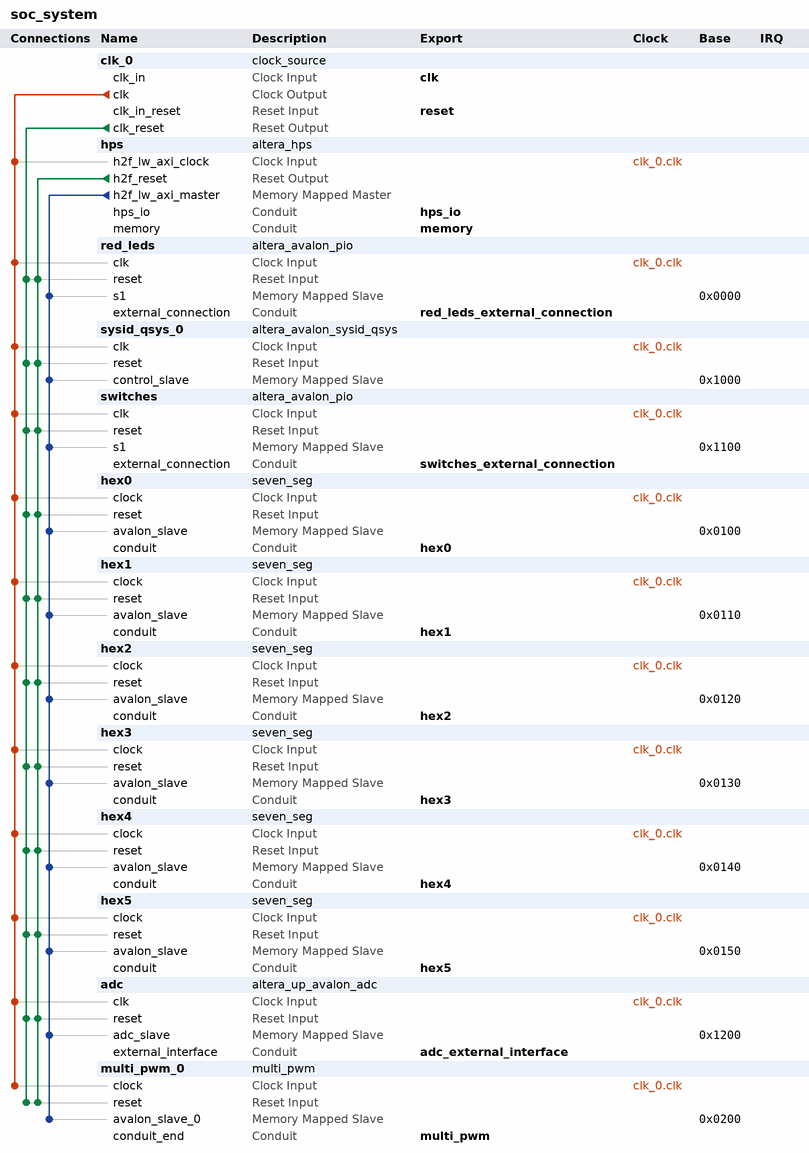
[diagram p0: system contents]
# Platform Designer (Qsys) system soc_system, Cyclone V 5CSEMA5F31C6
# Parameters at their usual value, and those the tool derives, are not listed.
package require -exact qsys 17.0
create_system soc_system
set_project_property DEVICE_FAMILY {Cyclone V}
set_project_property DEVICE 5CSEMA5F31C6

add_instance clk_0 clock_source 17.0
set_instance_parameter_value clk_0 clockFrequency 50000000

add_instance hps altera_hps 17.0
set_instance_parameter_value hps EMAC1_Mode RGMII
set_instance_parameter_value hps EMAC1_PinMuxing {HPS I/O Set 0}
set_instance_parameter_value hps F2SCLK_COLDRST_Enable false
set_instance_parameter_value hps F2SCLK_DBGRST_Enable false
set_instance_parameter_value hps F2SCLK_WARMRST_Enable false
set_instance_parameter_value hps F2SINTERRUPT_Enable false
set_instance_parameter_value hps F2S_Width 0
set_instance_parameter_value hps FPGA_PERIPHERAL_OUTPUT_CLOCK_FREQ_EMAC0_GTX_CLK 125
set_instance_parameter_value hps FPGA_PERIPHERAL_OUTPUT_CLOCK_FREQ_EMAC0_MD_CLK 2.5
set_instance_parameter_value hps FPGA_PERIPHERAL_OUTPUT_CLOCK_FREQ_EMAC1_GTX_CLK 125
set_instance_parameter_value hps FPGA_PERIPHERAL_OUTPUT_CLOCK_FREQ_EMAC1_MD_CLK 2.5
set_instance_parameter_value hps HPS_PROTOCOL DDR3
set_instance_parameter_value hps I2C0_Mode I2C
set_instance_parameter_value hps I2C0_PinMuxing {HPS I/O Set 0}
set_instance_parameter_value hps I2C1_Mode I2C
set_instance_parameter_value hps I2C1_PinMuxing {HPS I/O Set 0}
set_instance_parameter_value hps LWH2F_Enable true
set_instance_parameter_value hps MEM_BANKADDR_WIDTH 3
set_instance_parameter_value hps MEM_CLK_FREQ 400.0
set_instance_parameter_value hps MEM_COL_ADDR_WIDTH 10
set_instance_parameter_value hps MEM_DQ_WIDTH 32
set_instance_parameter_value hps MEM_DRV_STR RZQ/7
set_instance_parameter_value hps MEM_ROW_ADDR_WIDTH 15
set_instance_parameter_value hps MEM_RTT_NOM RZQ/4
set_instance_parameter_value hps MEM_RTT_WR RZQ/4
set_instance_parameter_value hps MEM_TCL 11
set_instance_parameter_value hps MEM_TFAW_NS 30.0
set_instance_parameter_value hps MEM_TRAS_NS 35.0
set_instance_parameter_value hps MEM_TRCD_NS 13.75
set_instance_parameter_value hps MEM_TRFC_NS 260.0
set_instance_parameter_value hps MEM_TRP_NS 13.75
set_instance_parameter_value hps MEM_VENDOR Other
set_instance_parameter_value hps MEM_WTCL 8
set_instance_parameter_value hps QSPI_Mode N/A
set_instance_parameter_value hps QSPI_PinMuxing Unused
set_instance_parameter_value hps REF_CLK_FREQ 25.0
set_instance_parameter_value hps S2FCLK_USER2CLK 5
set_instance_parameter_value hps S2F_Width 0
set_instance_parameter_value hps SDIO_Mode {4-bit Data}
set_instance_parameter_value hps SDIO_PinMuxing {HPS I/O Set 0}
set_instance_parameter_value hps SPIM1_Mode {Single Slave Select}
set_instance_parameter_value hps SPIM1_PinMuxing {HPS I/O Set 0}
set_instance_parameter_value hps STM_Enable false
set_instance_parameter_value hps TIMING_BOARD_AC_SKEW 0.02
set_instance_parameter_value hps TIMING_BOARD_AC_TO_CK_SKEW 0.01
set_instance_parameter_value hps TIMING_BOARD_DQ_TO_DQS_SKEW 0.05
set_instance_parameter_value hps TIMING_BOARD_MAX_CK_DELAY 0.03
set_instance_parameter_value hps TIMING_BOARD_MAX_DQS_DELAY 0.02
set_instance_parameter_value hps TIMING_BOARD_SKEW_BETWEEN_DQS 0.06
set_instance_parameter_value hps TIMING_BOARD_SKEW_CKDQS_DIMM_MAX 0.12
set_instance_parameter_value hps TIMING_BOARD_SKEW_CKDQS_DIMM_MIN 0.06
set_instance_parameter_value hps TIMING_BOARD_SKEW_WITHIN_DQS 0.01
set_instance_parameter_value hps TIMING_TDH 65
set_instance_parameter_value hps TIMING_TDQSCK 255
set_instance_parameter_value hps TIMING_TDQSQ 125
set_instance_parameter_value hps TIMING_TDS 30
set_instance_parameter_value hps TIMING_TIH 140
set_instance_parameter_value hps TIMING_TIS 180
set_instance_parameter_value hps TIMING_TQSH 0.4
set_instance_parameter_value hps UART0_Mode {No Flow Control}
set_instance_parameter_value hps UART0_PinMuxing {HPS I/O Set 0}
set_instance_parameter_value hps USB1_Mode SDR
set_instance_parameter_value hps USB1_PinMuxing {HPS I/O Set 0}
set_instance_parameter_value hps desired_cfg_clk_mhz 100.0
set_instance_parameter_value hps desired_qspi_clk_mhz 400.0
set_instance_parameter_value hps use_default_mpu_clk false

add_instance red_leds altera_avalon_pio 17.0
set_instance_parameter_value red_leds direction Output
set_instance_parameter_value red_leds width 10

add_instance sysid_qsys_0 altera_avalon_sysid_qsys 17.0
set_instance_parameter_value sysid_qsys_0 id 0

add_instance switches altera_avalon_pio 17.0
set_instance_parameter_value switches direction Input
set_instance_parameter_value switches width 10

add_instance hex0 seven_seg 1.0

add_instance hex1 seven_seg 1.0

add_instance hex2 seven_seg 1.0

add_instance hex3 seven_seg 1.0

add_instance hex4 seven_seg 1.0

add_instance hex5 seven_seg 1.0

add_instance adc altera_up_avalon_adc 17.0
set_instance_parameter_value adc board DE1-SoC
set_instance_parameter_value adc board_rev {F or newer}
set_instance_parameter_value adc numch_ 8

add_instance multi_pwm_0 multi_pwm 1.0
set_instance_parameter_value multi_pwm_0 W 31

# connections
add_connection clk_0.clk adc.clk clock
add_connection clk_0.clk hex0.clock clock
add_connection clk_0.clk hex1.clock clock
add_connection clk_0.clk hex2.clock clock
add_connection clk_0.clk hex3.clock clock
add_connection clk_0.clk hex4.clock clock
add_connection clk_0.clk hex5.clock clock
add_connection clk_0.clk hps.h2f_lw_axi_clock clock
add_connection clk_0.clk multi_pwm_0.clock clock
add_connection clk_0.clk red_leds.clk clock
add_connection clk_0.clk switches.clk clock
add_connection clk_0.clk sysid_qsys_0.clk clock
add_connection clk_0.clk_reset adc.reset reset
add_connection clk_0.clk_reset hex0.reset reset
add_connection clk_0.clk_reset hex1.reset reset
add_connection clk_0.clk_reset hex2.reset reset
add_connection clk_0.clk_reset hex3.reset reset
add_connection clk_0.clk_reset hex4.reset reset
add_connection clk_0.clk_reset hex5.reset reset
add_connection clk_0.clk_reset multi_pwm_0.reset reset
add_connection clk_0.clk_reset red_leds.reset reset
add_connection clk_0.clk_reset switches.reset reset
add_connection clk_0.clk_reset sysid_qsys_0.reset reset
add_connection hps.h2f_reset adc.reset reset
add_connection hps.h2f_reset hex0.reset reset
add_connection hps.h2f_reset hex1.reset reset
add_connection hps.h2f_reset hex2.reset reset
add_connection hps.h2f_reset hex3.reset reset
add_connection hps.h2f_reset hex4.reset reset
add_connection hps.h2f_reset hex5.reset reset
add_connection hps.h2f_reset multi_pwm_0.reset reset
add_connection hps.h2f_reset red_leds.reset reset
add_connection hps.h2f_reset switches.reset reset
add_connection hps.h2f_reset sysid_qsys_0.reset reset
add_connection hps.h2f_lw_axi_master adc.adc_slave avalon
set_connection_parameter_value hps.h2f_lw_axi_master/adc.adc_slave baseAddress 0x1200
add_connection hps.h2f_lw_axi_master hex0.avalon_slave avalon
set_connection_parameter_value hps.h2f_lw_axi_master/hex0.avalon_slave baseAddress 0x0100
add_connection hps.h2f_lw_axi_master hex1.avalon_slave avalon
set_connection_parameter_value hps.h2f_lw_axi_master/hex1.avalon_slave baseAddress 0x0110
add_connection hps.h2f_lw_axi_master hex2.avalon_slave avalon
set_connection_parameter_value hps.h2f_lw_axi_master/hex2.avalon_slave baseAddress 0x0120
add_connection hps.h2f_lw_axi_master hex3.avalon_slave avalon
set_connection_parameter_value hps.h2f_lw_axi_master/hex3.avalon_slave baseAddress 0x0130
add_connection hps.h2f_lw_axi_master hex4.avalon_slave avalon
set_connection_parameter_value hps.h2f_lw_axi_master/hex4.avalon_slave baseAddress 0x0140
add_connection hps.h2f_lw_axi_master hex5.avalon_slave avalon
set_connection_parameter_value hps.h2f_lw_axi_master/hex5.avalon_slave baseAddress 0x0150
add_connection hps.h2f_lw_axi_master multi_pwm_0.avalon_slave_0 avalon
set_connection_parameter_value hps.h2f_lw_axi_master/multi_pwm_0.avalon_slave_0 baseAddress 0x0200
add_connection hps.h2f_lw_axi_master red_leds.s1 avalon
set_connection_parameter_value hps.h2f_lw_axi_master/red_leds.s1 baseAddress 0x0000
add_connection hps.h2f_lw_axi_master switches.s1 avalon
set_connection_parameter_value hps.h2f_lw_axi_master/switches.s1 baseAddress 0x1100
add_connection hps.h2f_lw_axi_master sysid_qsys_0.control_slave avalon
set_connection_parameter_value hps.h2f_lw_axi_master/sysid_qsys_0.control_slave baseAddress 0x1000

# exported interfaces
add_interface adc_external_interface conduit end
set_interface_property adc_external_interface EXPORT_OF adc.external_interface
add_interface clk clock sink
set_interface_property clk EXPORT_OF clk_0.clk_in
add_interface hex0 conduit end
set_interface_property hex0 EXPORT_OF hex0.conduit
add_interface hex1 conduit end
set_interface_property hex1 EXPORT_OF hex1.conduit
add_interface hex2 conduit end
set_interface_property hex2 EXPORT_OF hex2.conduit
add_interface hex3 conduit end
set_interface_property hex3 EXPORT_OF hex3.conduit
add_interface hex4 conduit end
set_interface_property hex4 EXPORT_OF hex4.conduit
add_interface hex5 conduit end
set_interface_property hex5 EXPORT_OF hex5.conduit
add_interface hps_io conduit end
set_interface_property hps_io EXPORT_OF hps.hps_io
add_interface memory conduit end
set_interface_property memory EXPORT_OF hps.memory
add_interface multi_pwm conduit end
set_interface_property multi_pwm EXPORT_OF multi_pwm_0.conduit_end
add_interface red_leds_external_connection conduit end
set_interface_property red_leds_external_connection EXPORT_OF red_leds.external_connection
add_interface reset reset sink
set_interface_property reset EXPORT_OF clk_0.clk_in_reset
add_interface switches_external_connection conduit end
set_interface_property switches_external_connection EXPORT_OF switches.external_connection

set_interconnect_requirement {$system} qsys_mm.clockCrossingAdapter HANDSHAKE
set_interconnect_requirement {$system} qsys_mm.enableEccProtection FALSE
set_interconnect_requirement {$system} qsys_mm.insertDefaultSlave FALSE
set_interconnect_requirement {$system} qsys_mm.maxAdditionalLatency 1

save_system soc_system.qsys
